# Altium schematic sheet Frist_Mechanical_Arm_SCH.SchDoc
size A3
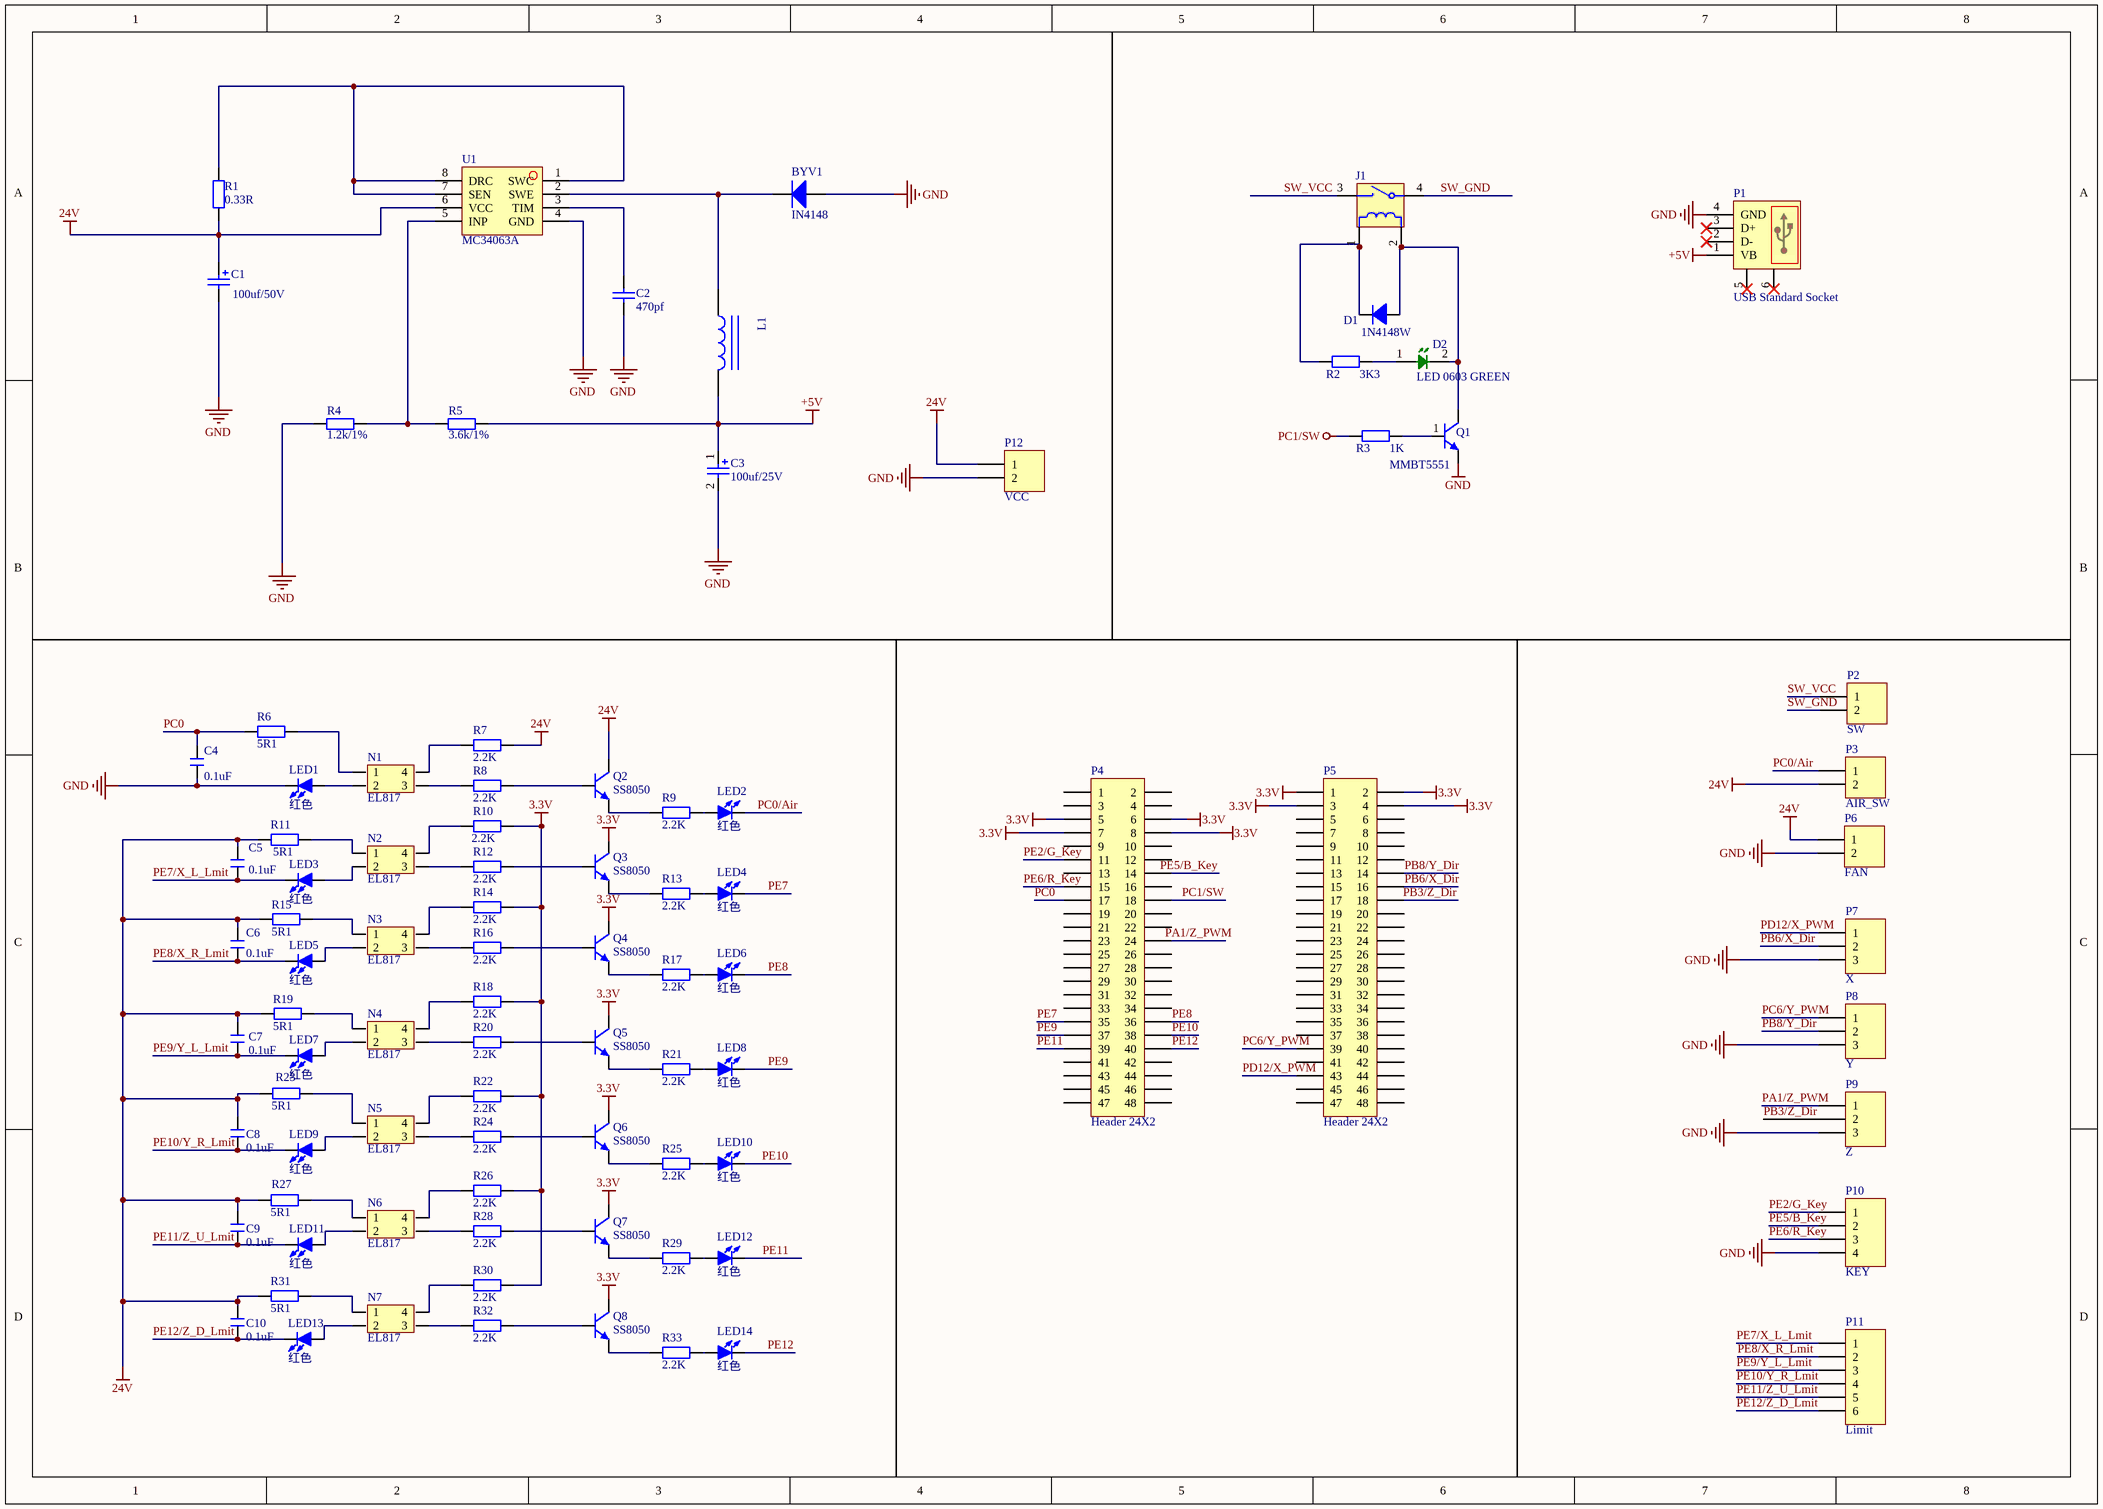
[diagram p0: Frist_Mechanical_Arm_SCH.SchDoc]

## Parts
BYV1  Model: IN4148  [SMA]  (hidden comment: BYV10-40)
C1  Voltage: 100uf/50V  [CS 5.0*10*13 - R]  (hidden comment: 100uf)
C2  470pf  [0603S]
C3  value 100uf/25V  [CASE7343]  (hidden comment: Cap Pol)
C4  0.1uF  [C 0805]
C5  0.1uF  [C 0805]
C6  0.1uF  [C 0805]
C7  0.1uF  [C 0805]
C8  0.1uF  [C 0805]
C9  0.1uF  [C 0805]
C10  0.1uF  [C 0805]
D1  1N4148W  [SOD123]
D2  LED 0603 GREEN  [LED0805]
J1  JDQ  [APAN3112]  (value not drawn)
L1  (no value)  [L-SMD1010]
LED1  红色  [LED 0805G]
LED2  红色  [LED 0805G]
LED3  红色  [LED 0805G]
LED4  红色  [LED 0805G]
LED5  红色  [LED 0805G]
LED6  红色  [LED 0805G]
LED7  红色  [LED 0805G]
LED8  红色  [LED 0805G]
LED9  红色  [LED 0805G]
LED10  红色  [LED 0805G]
LED11  红色  [LED 0805G]
LED12  红色  [LED 0805G]
LED13  红色  [LED 0805G]
LED14  红色  [LED 0805G]
N1  EL817  [LC-DIP-4]
N2  EL817  [LC-DIP-4]
N3  EL817  [LC-DIP-4]
N4  EL817  [LC-DIP-4]
N5  EL817  [LC-DIP-4]
N6  EL817  [LC-DIP-4]
N7  EL817  [LC-DIP-4]
P1  USB Standard Socket  [USB Standard Socket]
P2  SW  [KF128-3.81-2P]
P3  AIR_SW  [KF128-5.08-2P]
P4  Header 24X2  [HDR2X24]
P5  Header 24X2  [HDR2X24]
P6  FAN  [KF128-5.08-2P]
P7  X  [KF128-5.08-3P]
P8  Y  [KF128-5.08-3P]
P9  Z  [KF128-5.08-3P]
P10  KEY  [KF128-5.08-4P]
P11  Limit  [KF128-5.08-6P]
P12  VCC  [KF128-5.08-2P]
Q1  MMBT5551  [SOT23-3]
Q2  SS8050  [SOT23-3N]
Q3  SS8050  [SOT23-3N]
Q4  SS8050  [SOT23-3N]
Q5  SS8050  [SOT23-3N]
Q6  SS8050  [SOT23-3N]
Q7  SS8050  [SOT23-3N]
Q8  SS8050  [SOT23-3N]
R1  0.33R  [1206R]
R2  3K3  [0603R]
R3  1K  [0603R]
R4  1.2k/1%  [0603R]
R5  3.6k/1%  [0603R]
R6  5R1  [R 0805]
R7  2.2K  [R 0805]
R8  2.2K  [R 0805]
R9  2.2K  [R 0805]
R10  2.2K  [R 0805]
R11  5R1  [R 0805]
R12  2.2K  [R 0805]
R13  2.2K  [R 0805]
R14  2.2K  [R 0805]
R15  5R1  [R 0805]
R16  2.2K  [R 0805]
R17  2.2K  [R 0805]
R18  2.2K  [R 0805]
R19  5R1  [R 0805]
R20  2.2K  [R 0805]
R21  2.2K  [R 0805]
R22  2.2K  [R 0805]
R23  5R1  [R 0805]
R24  2.2K  [R 0805]
R25  2.2K  [R 0805]
R26  2.2K  [R 0805]
R27  5R1  [R 0805]
R28  2.2K  [R 0805]
R29  2.2K  [R 0805]
R30  2.2K  [R 0805]
R31  5R1  [R 0805]
R32  2.2K  [R 0805]
R33  2.2K  [R 0805]
U1  MC34063A  [SOP-8]

## Nets
3.3V: P4.5 P4.6 P4.7 P4.8 P5.1 P5.2 P5.3 P5.4 Q4.3(C) Q5.3(C) Q6.3(C) Q7.3(C) Q8.3(C) R10.2 R14.2 R18.2 R22.2 R26.2 R30.2
24V: C1.1 C5.2 C6.2 C7.2 C8.2 C9.2 C10.2 P3.2 P6.1 P12.1 Q2.3(C) R1.1 R7.2 R11.1 R15.1 R19.1 R23.1 R27.1 R31.1 U1.6(VCC)
+5V: C3.1 L1.2 P1.1(VB) R5.2
GND: BYV1.1(A) C1.2 C2.1 C3.2 C4.2 LED1.2(K) P1.4(GND) P6.2 P7.3 P8.3 P9.3 P10.4 P12.2 Q1.2 R4.1 U1.4(GND)
PC1/SW: P4.18 R3.1
PA1/Z_PWM: P4.24 P9.1
PB3/Z_Dir: P5.18 P9.2
PB6/X_Dir: P5.16 P7.2
PB8/Y_Dir: P5.14 P8.2
PC0: C4.1 P4.17 R6.1
PC0/Air: LED2.2(K) P3.1
PC6/Y_PWM: P5.39 P8.1
PD12/X_PWM: P5.43 P7.1
PE2/G_Key: P4.11 P10.1
PE5/B_Key: P4.14 P10.2
PE6/R_Key: P4.15 P10.3
PE7: LED4.2(K) P4.35
PE7/X_L_Lmit: C5.1 LED3.2(K) P11.1
PE8: LED6.2(K) P4.36
PE8/X_R_Lmit: C6.1 LED5.2(K) P11.2
PE9: LED8.2(K) P4.37
PE9/Y_L_Lmit: C7.1 LED7.2(K) P11.3
PE10: LED10.2(K) P4.38
PE10/Y_R_Lmit: C8.1 LED9.2(K) P11.4
PE11: LED12.2(K) P4.39
PE11/Z_U_Lmit: C9.1 LED11.2(K) P11.5
PE12: LED14.2(K) P4.40
PE12/Z_D_Lmit: C10.1 LED13.2(K) P11.6
SW_GND: J1.4 P2.2
SW_VCC: J1.3 P2.1
NetBYV1_2: BYV1.2(K) L1.1 U1.2(SWE)
NetC2_2: C2.2 U1.3(TIM)
NetD1_1: D1.1(A) D2.2 J1.2 Q1.3
NetD1_2: D1.2(K) J1.1 R2.1
NetD2_1: D2.1 R2.2
NetLED1_1: LED1.1(A) N1.2
NetLED2_1: LED2.1(A) R9.2
NetLED3_1: LED3.1(A) N2.2
NetLED4_1: LED4.1(A) R13.2
NetLED5_1: LED5.1(A) N3.2
NetLED6_1: LED6.1(A) R17.2
NetLED7_1: LED7.1(A) N4.2
NetLED8_1: LED8.1(A) R21.2
NetLED9_1: LED9.1(A) N5.2
NetLED10_1: LED10.1(A) R25.2
NetLED11_1: LED11.1(A) N6.2
NetLED12_1: LED12.1(A) R29.2
NetLED13_1: LED13.1(A) N7.2
NetLED14_1: LED14.1(A) R33.2
NetN1_1: N1.1 R6.2
NetN1_3: N1.3 R8.1
NetN1_4: N1.4 R7.1
NetN2_1: N2.1 R11.2
NetN2_3: N2.3 R12.1
NetN2_4: N2.4 R10.1
NetN3_1: N3.1 R15.2
NetN3_3: N3.3 R16.1
NetN3_4: N3.4 R14.1
NetN4_1: N4.1 R19.2
NetN4_3: N4.3 R20.1
NetN4_4: N4.4 R18.1
NetN5_1: N5.1 R23.2
NetN5_3: N5.3 R24.1
NetN5_4: N5.4 R22.1
NetN6_1: N6.1 R27.2
NetN6_3: N6.3 R28.1
NetN6_4: N6.4 R26.1
NetN7_1: N7.1 R31.2
NetN7_3: N7.3 R32.1
NetN7_4: N7.4 R30.1
NetQ1_1: Q1.1 R3.2
NetQ2_1: Q2.1(B) R8.2
NetQ2_2: Q2.2(E) R9.1
NetQ3_1: Q3.1(B) R12.2
NetQ3_2: Q3.2(E) R13.1
NetQ4_1: Q4.1(B) R16.2
NetQ4_2: Q4.2(E) R17.1
NetQ5_1: Q5.1(B) R20.2
NetQ5_2: Q5.2(E) R21.1
NetQ6_1: Q6.1(B) R24.2
NetQ6_2: Q6.2(E) R25.1
NetQ7_1: Q7.1(B) R28.2
NetQ7_2: Q7.2(E) R29.1
NetQ8_1: Q8.1(B) R32.2
NetQ8_2: Q8.2(E) R33.1
NetR1_2: R1.2 U1.1(SWC) U1.7(SEN) U1.8(DRC)
NetR4_2: R4.2 R5.1 U1.5(INP)

Not connected (* = marked no-connect by the designer): P1 2(D-)* 3(D+)* 5* 6*; P4 1 2 3 4 9 10 12 13 16 19 20 21 22 23 25 26 27 28 29 30 31 32 33 34 41 42 43 44 45 46 47 48; P5 5 6 7 8 9 10 11 12 13 15 17 19 20 21 22 23 24 25 26 27 28 29 30 31 32 33 34 35 36 37 38 40 41 42 44 45 46 47 48; Q3 3(C)

## Notes on the sheet
- Labels drawn without touching a wire or pin: 3.3V

## Library data of the parts
BYV1 = Diode  Glass: High Conductance Fast Diode; Revision 1: 11-Jul-2000: SIM Model Added.; Revision 2: 17-Jul-2002: Re-released for DXP Platform.; Code - JEDEC: DO-204-AH; Published: 8-Jun-2000; Datasheet: Latest Revision: 1997; Package Reference: DO-35; Publisher: Altium Limited
C1 = Cap Pol: Polarized Capacitor (Radial); Published: 8-Jun-2000; Revision: July-2002: Re-released for DXP Platform.; Publisher: Altium Limited; Value: 100uF
C2 = Cap: Capacitor; Published: 8-Jun-2000; LatestRevisionDate: 17-Jul-2002; LatestRevisionNote: Re-released for DXP Platform.; Publisher: Altium Limited
C3 = Cap Pol: Polarized Capacitor (Radial); Voltage: 16V; Published: 8-Jun-2000; Revision: July-2002: Re-released for DXP Platform.; Publisher: Altium Limited
C4-C10 = C: 无极性贴片电容; 版权归属: 源创客; BOM名称: 无极性贴片电容; 学习资源: www.ooocke.com
D1 = Diode: HIGH-SPEED   SWITCHING DIODE; Manufacturers: ST; 10 Price  RMB: 0.0624; 1000 Price  RMB: 0.0472
D2 = LED 0603 GREEN: 10 Price  RMB: 0.2; 1000 Price  RMB: 0.1; Manufacturers: *
J1 = PA1a
L1 = Inductor Iron: Magnetic-Core Inductor; Published: 24-Mar-1999; Revision: July-2002: Re-released for DXP Platform.; Publisher: Altium Limited
LED1-LED14 = LED-SMD: 贴片LED; 版权归属: 源创客; BOM名称: 贴片LED; 学习资源: www.ooocke.com
P1 = USB Standard Socket: 10 Price  RMB: 0.3; 1000 Price  RMB: 0.2; Manufacturers: *
P2 P3 P6 P12 = Header 2: Header, 2-Pin; LatestRevisionDate: 17-Jul-2002; LatestRevisionNote: Re-released for DXP Platform.; Publisher: Altium Limited
P4 P5 = Header 24X2: Header, 24-Pin, Dual row; LatestRevisionDate: 17-Jul-2002; LatestRevisionNote: Re-released for DXP Platform.; Publisher: Altium Limited
P7-P9 = Header 3: Header, 3-Pin; LatestRevisionDate: 17-Jul-2002; LatestRevisionNote: Re-released for DXP Platform.; Publisher: Altium Limited
P10 = Header 4: Header, 4-Pin; LatestRevisionDate: 17-Jul-2002; LatestRevisionNote: Re-released for DXP Platform.; Publisher: Altium Limited
P11 = Header 6: Header, 6-Pin; LatestRevisionDate: 17-Jul-2002; LatestRevisionNote: Re-released for DXP Platform.; Publisher: Altium Limited
Q1 = NPN: SOT-23 Plastic-Encapsulate Transistors; Manufacturers: ON/Fairchild/DIODES/UTC; 1000 Price  RMB: 0.06; 10 Price  RMB: 0.1
Q2-Q8 = 8050-SMD: 高频放大-NPN型; 版权归属: 源创客; 属性: 40V 1.5A 1W 100MHZ; BOM名称: 高频放大-NPN型; 学习资源: www.ooocke.com
R1 R4 R5 = Res2: Resistor; Manufacturer's Footprint: 0603; Manufacturers: YAGEO/UniOhm; 10 Price  RMB: 0.01; 1000 Price  RMB: 0.0031; Tolerance: 1%
R2 R3 = Res2: Resistor; 10 Price  RMB: 0.01; 1000 Price  RMB: 0.0031; Tolerance: 5%
R6-R33 = R: 贴片电阻; 版权归属: 源创客; BOM名称: 贴片电阻; 学习资源: www.ooocke.com